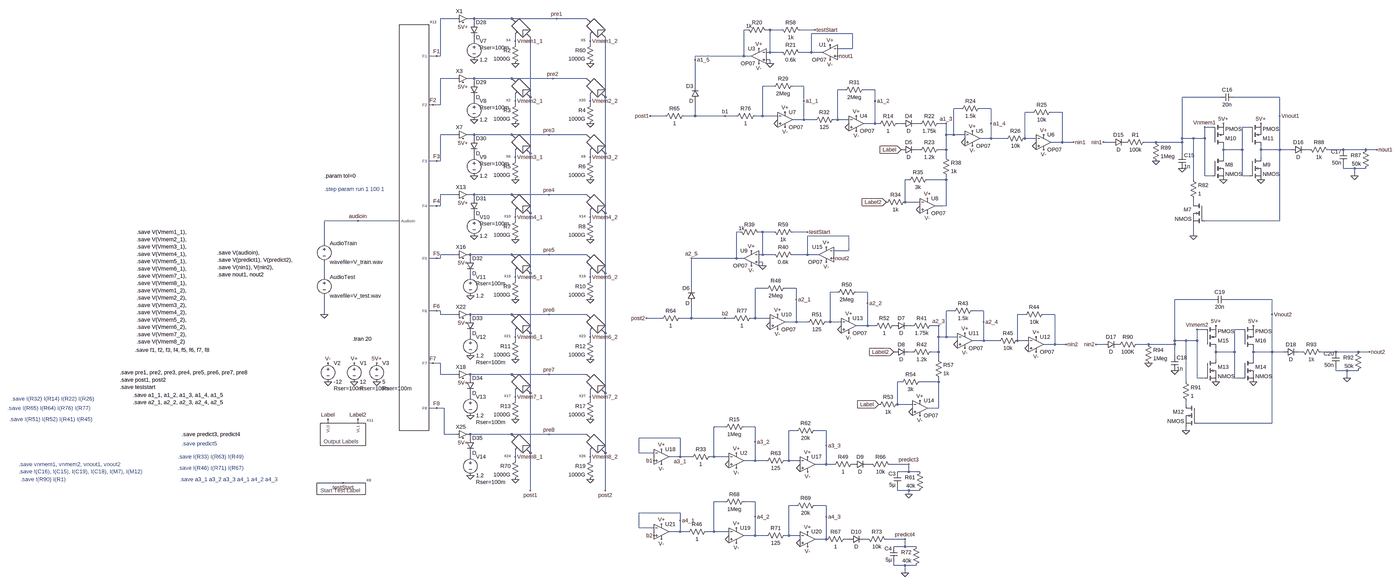
[diagram p0: schematic Net Array_SynapseResponse.asc, whole sheet]
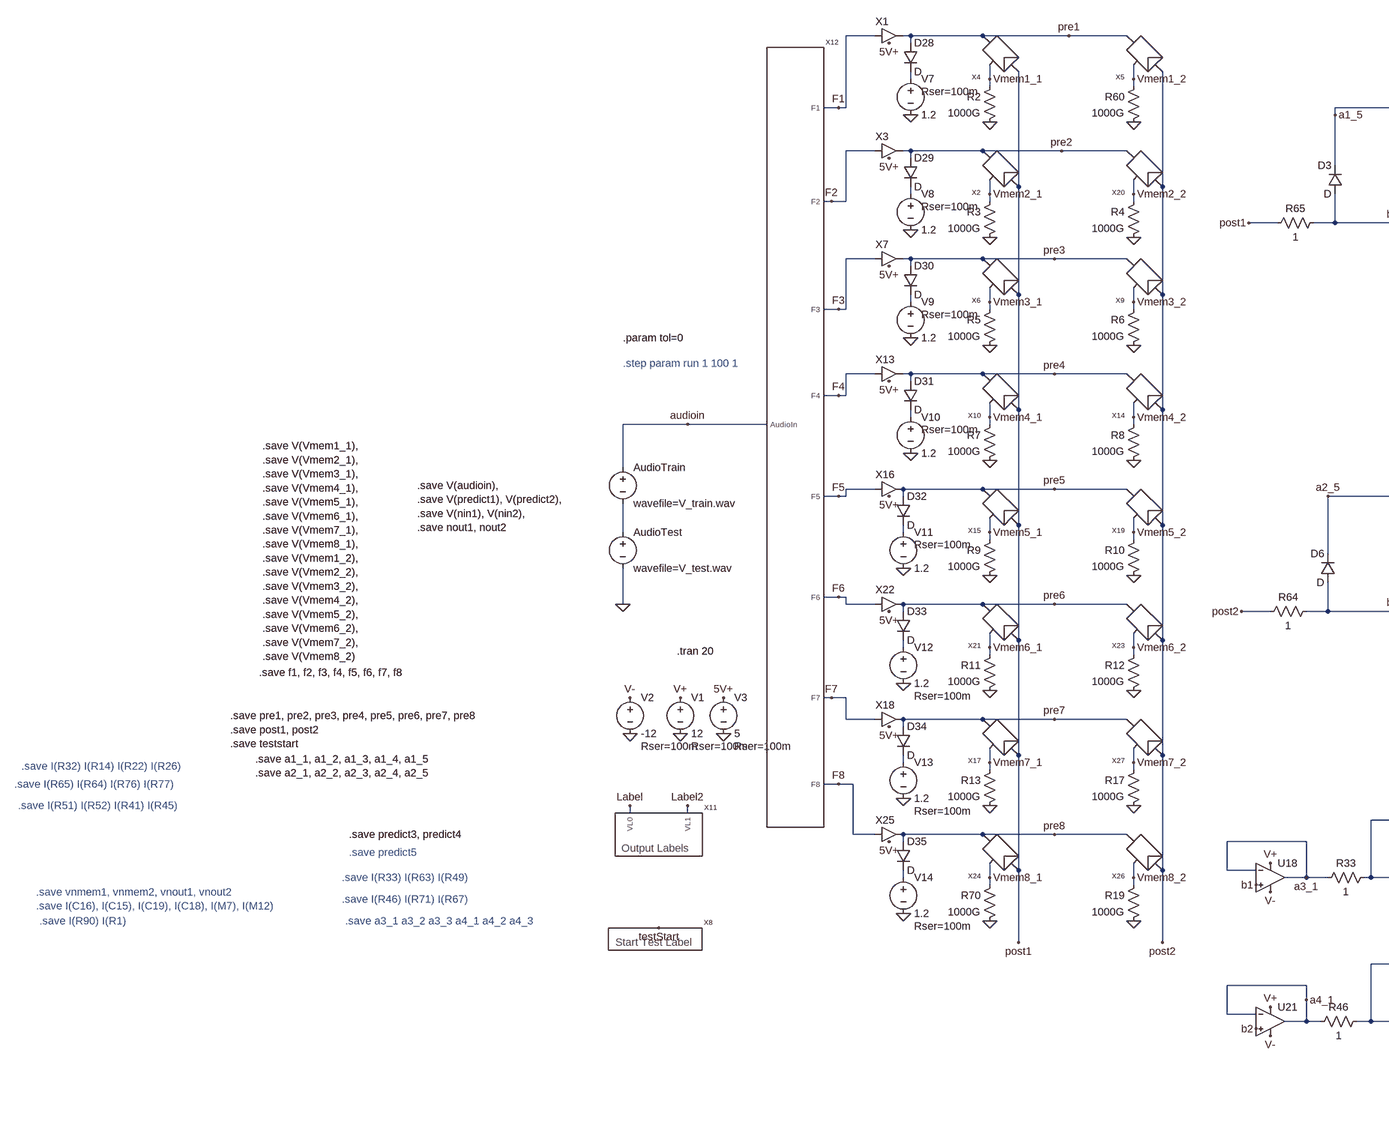
[diagram p1: schematic Net Array_SynapseResponse.asc, part, row 1 of 1, column 1 of 2]
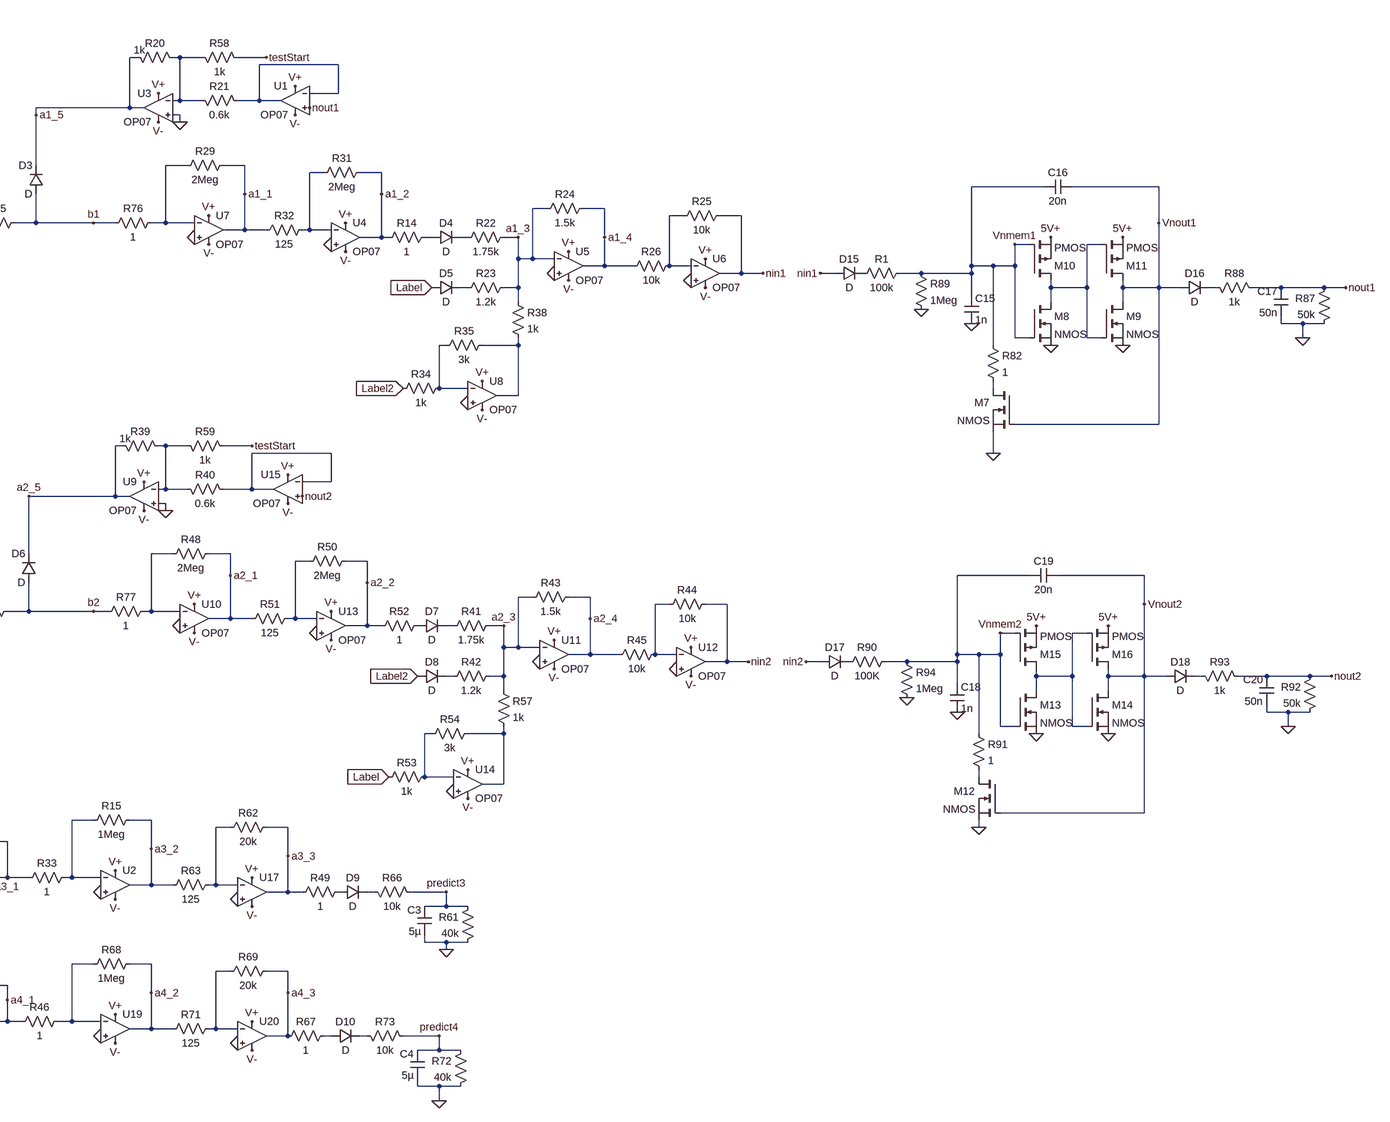
[diagram p2: schematic Net Array_SynapseResponse.asc, part, row 1 of 1, column 2 of 2]
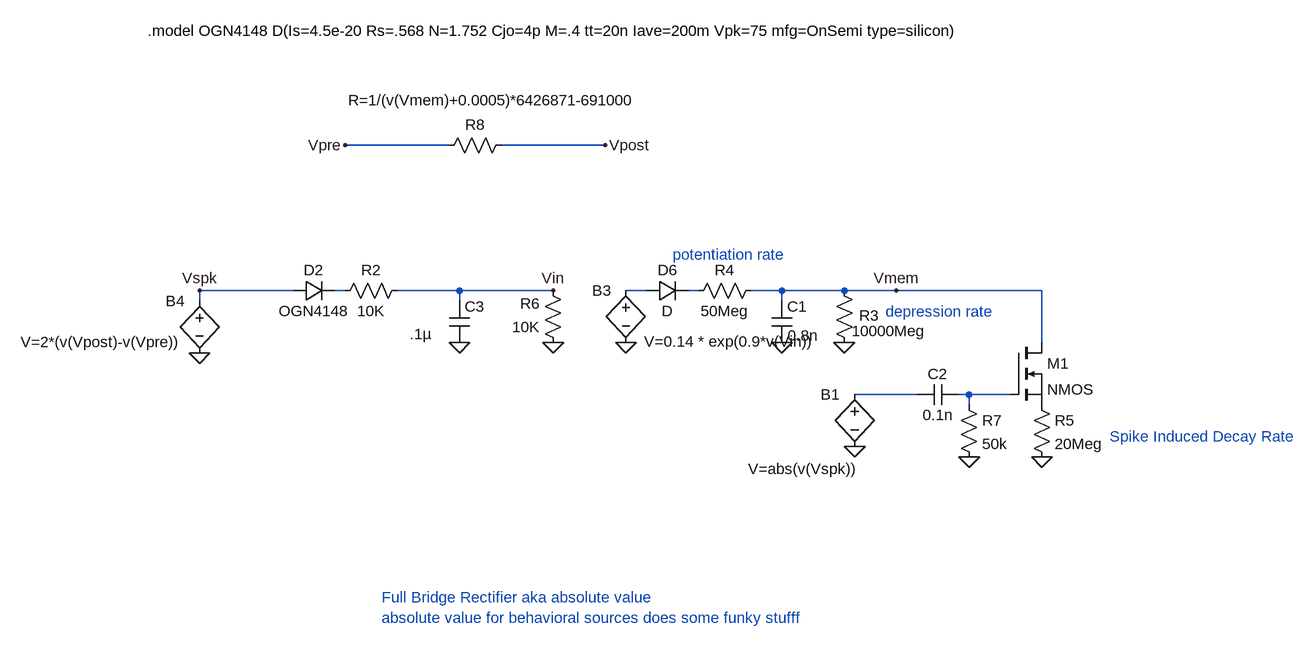
[diagram p3: sub-circuit synapse.asc]
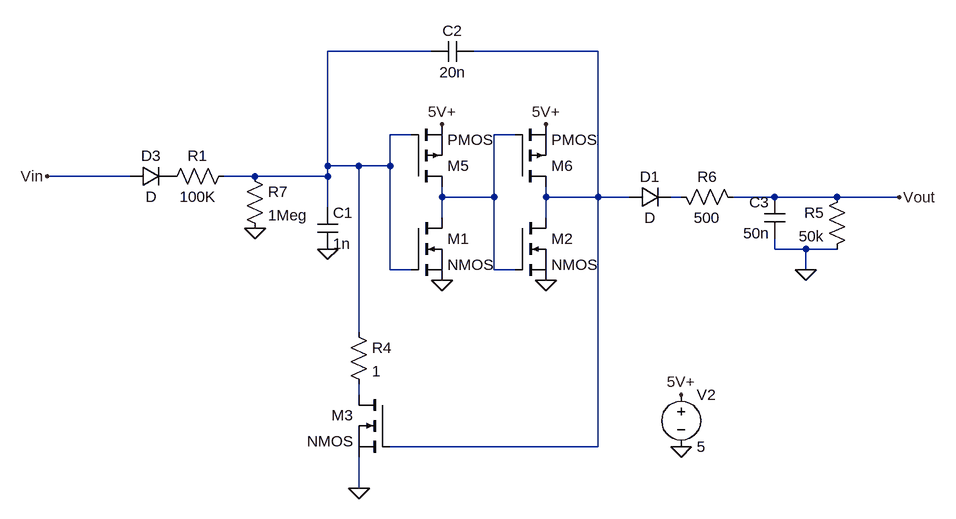
[diagram p4: sub-circuit ahp.asc]
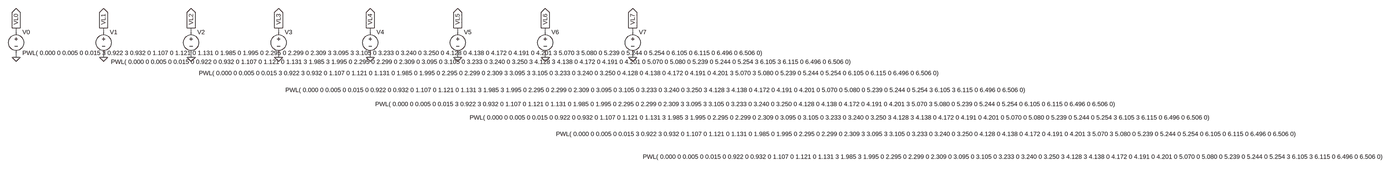
[diagram p5: sub-circuit outputlabels.asc, whole sheet]
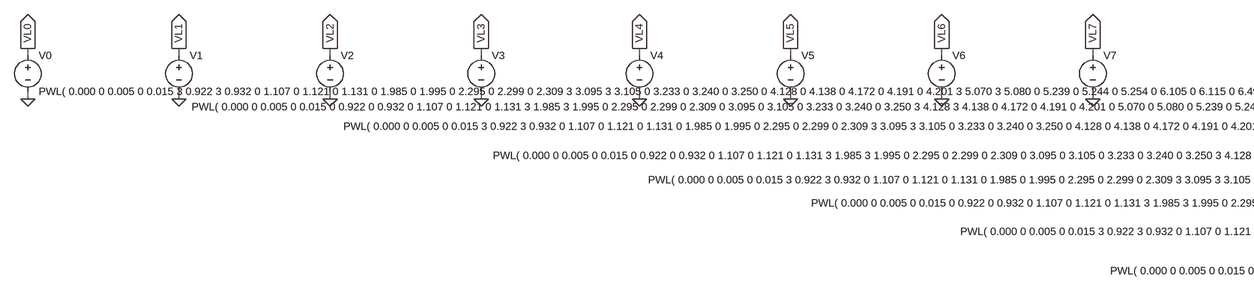
[diagram p6: sub-circuit outputlabels.asc, part, row 1 of 1, column 1 of 2]
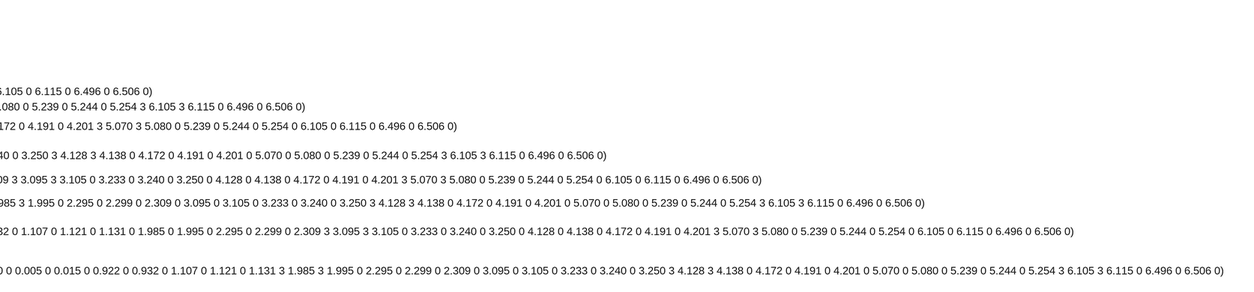
[diagram p7: sub-circuit outputlabels.asc, part, row 1 of 1, column 2 of 2]
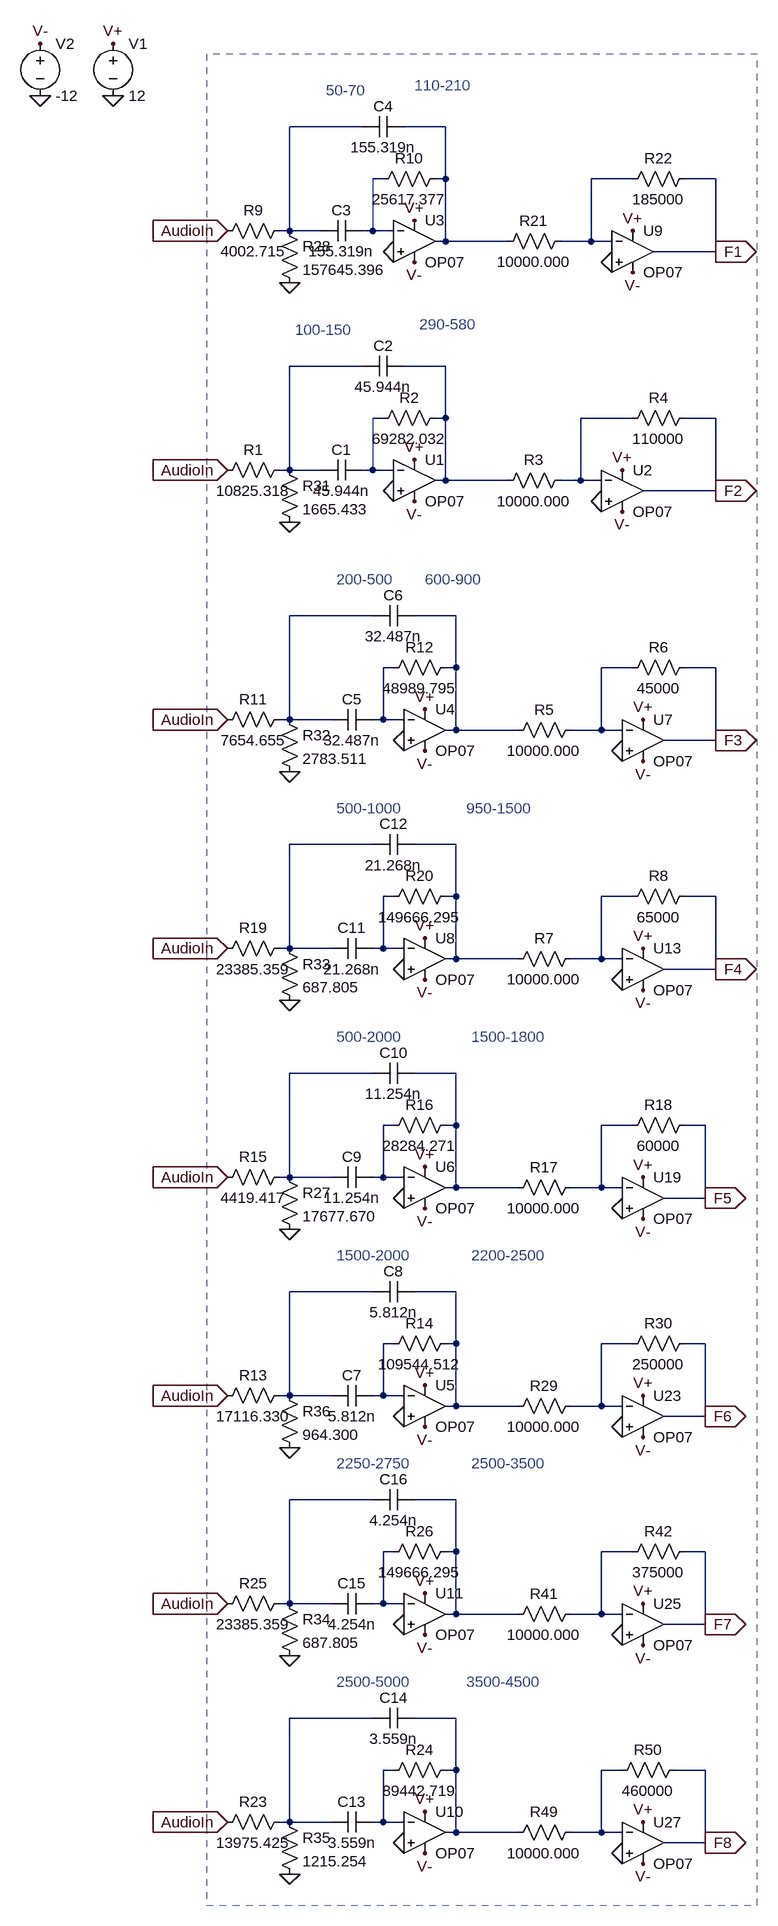
[diagram p8: sub-circuit filterbank.asc]
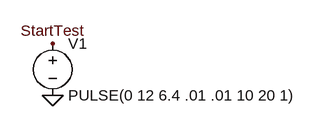
[diagram p9: sub-circuit starttestlabel.asc]
Net Array_SynapseResponse.asc, the LTspice schematic file:
Version 4
SHEET 1 5076 1864
WIRE 80 -1296 16 -1296
WIRE 160 -1296 144 -1296
WIRE 320 -1296 160 -1296
WIRE 512 -1296 320 -1296
WIRE 640 -1296 512 -1296
WIRE 160 -1280 160 -1296
WIRE 1328 -1248 1312 -1248
WIRE 1424 -1248 1408 -1248
WIRE 1472 -1248 1424 -1248
WIRE 1616 -1248 1552 -1248
WIRE 1776 -1232 1600 -1232
WIRE 160 -1200 160 -1216
WIRE 336 -1200 336 -1232
WIRE 656 -1200 656 -1232
WIRE 336 -1184 336 -1200
WIRE 656 -1184 656 -1200
WIRE 1776 -1168 1776 -1232
WIRE 1776 -1168 1712 -1168
WIRE 1424 -1152 1424 -1248
WIRE 1424 -1152 1408 -1152
WIRE 1472 -1152 1424 -1152
WIRE 1600 -1152 1600 -1232
WIRE 1600 -1152 1552 -1152
WIRE 1648 -1152 1600 -1152
WIRE 0 -1136 -32 -1136
WIRE 16 -1136 16 -1296
WIRE 16 -1136 0 -1136
WIRE 1312 -1136 1312 -1248
WIRE 1312 -1136 1104 -1136
WIRE 1344 -1136 1312 -1136
WIRE 1104 -1120 1104 -1136
WIRE 1424 -1120 1408 -1120
WIRE 1424 -1104 1424 -1120
WIRE 80 -1040 16 -1040
WIRE 160 -1040 144 -1040
WIRE 320 -1040 160 -1040
WIRE 496 -1040 320 -1040
WIRE 640 -1040 496 -1040
WIRE 160 -1024 160 -1040
WIRE 1104 -1008 1104 -1120
WIRE 1440 -1008 1392 -1008
WIRE 1568 -1008 1520 -1008
WIRE 1744 -992 1712 -992
WIRE 1872 -992 1824 -992
WIRE 400 -960 400 -1216
WIRE 720 -960 720 -1216
WIRE 3344 -960 3184 -960
WIRE 3600 -960 3408 -960
WIRE 160 -944 160 -960
WIRE 336 -944 336 -976
WIRE 656 -944 656 -976
WIRE 1568 -944 1568 -1008
WIRE 1872 -944 1872 -992
WIRE -16 -928 -32 -928
WIRE 16 -928 16 -1040
WIRE 16 -928 -16 -928
WIRE 336 -928 336 -944
WIRE 656 -928 656 -944
WIRE 2240 -912 2208 -912
WIRE 2368 -912 2320 -912
WIRE 2544 -896 2512 -896
WIRE 2672 -896 2624 -896
WIRE 976 -880 912 -880
WIRE 1104 -880 1104 -944
WIRE 1104 -880 1056 -880
WIRE 1232 -880 1104 -880
WIRE 1280 -880 1232 -880
WIRE 1392 -880 1392 -1008
WIRE 1392 -880 1360 -880
WIRE 1456 -880 1392 -880
WIRE 3600 -880 3600 -960
WIRE 1568 -864 1568 -944
WIRE 1568 -864 1520 -864
WIRE 1616 -864 1568 -864
WIRE 1712 -864 1712 -992
WIRE 1712 -864 1696 -864
WIRE 1760 -864 1712 -864
WIRE 1872 -848 1872 -944
WIRE 1872 -848 1824 -848
WIRE 1888 -848 1872 -848
WIRE 1984 -848 1968 -848
WIRE 2064 -848 2048 -848
WIRE 2176 -848 2144 -848
WIRE 2368 -848 2368 -912
WIRE 3312 -832 3280 -832
WIRE 3472 -832 3440 -832
WIRE 80 -800 16 -800
WIRE 160 -800 144 -800
WIRE 320 -800 160 -800
WIRE 480 -800 320 -800
WIRE 640 -800 480 -800
WIRE 2176 -800 2176 -848
WIRE 2208 -800 2208 -912
WIRE 2208 -800 2176 -800
WIRE 2256 -800 2208 -800
WIRE 160 -784 160 -800
WIRE 2368 -784 2368 -848
WIRE 2368 -784 2320 -784
WIRE 2432 -784 2368 -784
WIRE 2512 -784 2512 -896
WIRE 2560 -784 2512 -784
WIRE 3184 -784 3184 -960
WIRE 3232 -784 3184 -784
WIRE 3280 -784 3280 -832
WIRE 3280 -784 3232 -784
WIRE 2672 -768 2672 -896
WIRE 2672 -768 2624 -768
WIRE 2720 -768 2672 -768
WIRE 2880 -768 2848 -768
WIRE 3072 -768 3024 -768
WIRE 3184 -768 3184 -784
WIRE 3184 -768 3072 -768
WIRE 2064 -736 2048 -736
WIRE 2176 -736 2176 -800
WIRE 2176 -736 2144 -736
WIRE 3360 -736 3360 -752
WIRE 3440 -736 3440 -832
WIRE 3440 -736 3360 -736
WIRE 3520 -736 3520 -752
WIRE 3600 -736 3600 -880
WIRE 3600 -736 3520 -736
WIRE 3648 -736 3600 -736
WIRE 3728 -736 3712 -736
WIRE 3872 -736 3808 -736
WIRE 3968 -736 3872 -736
WIRE 4016 -736 3968 -736
WIRE 400 -720 400 -960
WIRE 720 -720 720 -960
WIRE 3184 -720 3184 -768
WIRE 160 -704 160 -720
WIRE 336 -704 336 -736
WIRE 656 -704 656 -736
WIRE 2176 -704 2176 -736
WIRE 3360 -704 3360 -736
WIRE 3520 -704 3520 -736
WIRE 0 -688 -32 -688
WIRE 16 -688 16 -800
WIRE 16 -688 0 -688
WIRE 336 -688 336 -704
WIRE 656 -688 656 -704
WIRE 3872 -656 3872 -672
WIRE 3920 -656 3872 -656
WIRE 3968 -656 3920 -656
WIRE 3280 -624 3280 -784
WIRE 3312 -624 3280 -624
WIRE 3440 -624 3440 -736
WIRE 3472 -624 3440 -624
WIRE 3920 -624 3920 -656
WIRE 2016 -608 2000 -608
WIRE 2176 -608 2176 -624
WIRE 2176 -608 2096 -608
WIRE 3232 -608 3232 -784
WIRE 80 -544 16 -544
WIRE 160 -544 144 -544
WIRE 320 -544 160 -544
WIRE 480 -544 320 -544
WIRE 640 -544 480 -544
WIRE 160 -528 160 -544
WIRE 2000 -512 2000 -608
WIRE 2064 -512 2000 -512
WIRE 3232 -512 3232 -528
WIRE 0 -496 -32 -496
WIRE 16 -496 16 -544
WIRE 16 -496 0 -496
WIRE 2176 -496 2176 -608
WIRE 2176 -496 2128 -496
WIRE 400 -464 400 -720
WIRE 720 -464 720 -720
WIRE 160 -448 160 -464
WIRE 336 -448 336 -480
WIRE 656 -448 656 -480
WIRE -336 -432 -480 -432
WIRE -160 -432 -336 -432
WIRE 336 -432 336 -448
WIRE 656 -432 656 -448
WIRE 3600 -432 3600 -736
WIRE 3600 -432 3280 -432
WIRE 1296 -384 1280 -384
WIRE 1392 -384 1376 -384
WIRE 1440 -384 1392 -384
WIRE 1584 -384 1520 -384
WIRE 1760 -368 1584 -368
WIRE 3232 -368 3232 -416
WIRE -480 -336 -480 -432
WIRE 1760 -304 1760 -368
WIRE 1760 -304 1696 -304
WIRE 80 -288 16 -288
WIRE 320 -288 144 -288
WIRE 480 -288 320 -288
WIRE 640 -288 480 -288
WIRE 1392 -288 1392 -384
WIRE 1392 -288 1376 -288
WIRE 1440 -288 1392 -288
WIRE 1584 -288 1584 -368
WIRE 1584 -288 1520 -288
WIRE 1632 -288 1584 -288
WIRE 0 -272 -32 -272
WIRE 16 -272 16 -288
WIRE 16 -272 0 -272
WIRE 144 -272 144 -288
WIRE 1280 -272 1280 -384
WIRE 1280 -272 1088 -272
WIRE 1312 -272 1280 -272
WIRE 1392 -256 1376 -256
WIRE 1392 -240 1392 -256
WIRE 400 -208 400 -464
WIRE 720 -208 720 -464
WIRE -480 -192 -480 -256
WIRE 144 -192 144 -208
WIRE 336 -192 336 -224
WIRE 656 -192 656 -224
WIRE 336 -176 336 -192
WIRE 656 -176 656 -192
WIRE 1088 -144 1088 -272
WIRE 1408 -144 1360 -144
WIRE 1536 -144 1488 -144
WIRE 1712 -128 1680 -128
WIRE 1840 -128 1792 -128
WIRE 1536 -96 1536 -144
WIRE 3312 -96 3152 -96
WIRE 3568 -96 3376 -96
WIRE 1840 -80 1840 -128
WIRE 0 -48 -32 -48
WIRE 16 -48 0 -48
WIRE 2208 -48 2176 -48
WIRE 2336 -48 2288 -48
WIRE -480 -32 -480 -112
WIRE 16 -32 16 -48
WIRE 80 -32 16 -32
WIRE 320 -32 144 -32
WIRE 480 -32 320 -32
WIRE 640 -32 480 -32
WIRE 2512 -32 2480 -32
WIRE 2640 -32 2592 -32
WIRE 3568 -32 3568 -96
WIRE 144 -16 144 -32
WIRE 960 -16 896 -16
WIRE 1088 -16 1088 -80
WIRE 1088 -16 1040 -16
WIRE 1232 -16 1088 -16
WIRE 1264 -16 1232 -16
WIRE 1360 -16 1360 -144
WIRE 1360 -16 1344 -16
WIRE 1424 -16 1360 -16
WIRE 1536 0 1536 -96
WIRE 1536 0 1488 0
WIRE 1584 0 1536 0
WIRE 1680 0 1680 -128
WIRE 1680 0 1664 0
WIRE 1728 0 1680 0
WIRE 2336 0 2336 -48
WIRE 1840 16 1840 -80
WIRE 1840 16 1792 16
WIRE 1872 16 1840 16
WIRE 2032 16 2016 16
WIRE 2144 16 2112 16
WIRE 3280 32 3248 32
WIRE 3440 32 3408 32
WIRE 400 48 400 -208
WIRE 720 48 720 -208
WIRE 144 64 144 48
WIRE 336 64 336 32
WIRE 656 64 656 32
WIRE 2144 64 2144 16
WIRE 2176 64 2176 -48
WIRE 2176 64 2144 64
WIRE 2224 64 2176 64
WIRE 336 80 336 64
WIRE 656 80 656 64
WIRE 2336 80 2336 0
WIRE 2336 80 2288 80
WIRE 2400 80 2336 80
WIRE 2480 80 2480 -32
WIRE 2528 80 2480 80
WIRE 3152 80 3152 -96
WIRE 3200 80 3152 80
WIRE 3248 80 3248 32
WIRE 3248 80 3200 80
WIRE 2640 96 2640 -32
WIRE 2640 96 2592 96
WIRE 2688 96 2640 96
WIRE 2848 96 2816 96
WIRE 3040 96 2992 96
WIRE 3152 96 3152 80
WIRE 3152 96 3040 96
WIRE 2032 128 2016 128
WIRE 2144 128 2144 64
WIRE 2144 128 2112 128
WIRE 3328 128 3328 112
WIRE 3408 128 3408 32
WIRE 3408 128 3328 128
WIRE 3488 128 3488 112
WIRE 3568 128 3568 -32
WIRE 3568 128 3488 128
WIRE 3616 128 3568 128
WIRE 3696 128 3680 128
WIRE 3840 128 3776 128
WIRE 3936 128 3840 128
WIRE 3984 128 3936 128
WIRE 3152 144 3152 96
WIRE 2144 160 2144 128
WIRE 3328 160 3328 128
WIRE 3488 160 3488 128
WIRE -16 176 -32 176
WIRE 16 176 -16 176
WIRE 3840 208 3840 192
WIRE 3888 208 3840 208
WIRE 3936 208 3888 208
WIRE 16 224 16 176
WIRE 80 224 16 224
WIRE 320 224 144 224
WIRE 480 224 320 224
WIRE 640 224 480 224
WIRE 144 240 144 224
WIRE 3248 240 3248 80
WIRE 3280 240 3248 240
WIRE 3408 240 3408 128
WIRE 3440 240 3408 240
WIRE 3888 240 3888 208
WIRE 1984 256 1968 256
WIRE 2144 256 2144 240
WIRE 2144 256 2064 256
WIRE 3200 256 3200 80
WIRE 400 304 400 48
WIRE 720 304 720 48
WIRE 144 320 144 304
WIRE 336 320 336 288
WIRE 656 320 656 288
WIRE 336 336 336 320
WIRE 656 336 656 320
WIRE 1968 352 1968 256
WIRE 2032 352 1968 352
WIRE 3200 352 3200 336
WIRE 0 368 -32 368
WIRE 32 368 0 368
WIRE 2144 368 2144 256
WIRE 2144 368 2096 368
WIRE -464 432 -464 416
WIRE -336 432 -336 416
WIRE 3568 432 3568 128
WIRE 3568 432 3248 432
WIRE 1232 448 1184 448
WIRE 1360 448 1312 448
WIRE 1536 464 1504 464
WIRE 1664 464 1616 464
WIRE 3200 464 3200 448
WIRE 32 480 32 368
WIRE 80 480 32 480
WIRE 320 480 144 480
WIRE 480 480 320 480
WIRE 640 480 480 480
WIRE 144 496 144 480
WIRE 1040 496 864 496
WIRE 1360 512 1360 448
WIRE 1664 528 1664 464
WIRE 400 560 400 304
WIRE 720 560 720 304
WIRE 864 560 864 496
WIRE 928 560 864 560
WIRE 144 576 144 560
WIRE 336 576 336 544
WIRE 656 576 656 544
WIRE 1040 576 1040 496
WIRE 1040 576 992 576
WIRE 1088 576 1040 576
WIRE 1184 576 1184 448
WIRE 1184 576 1168 576
WIRE 1248 576 1184 576
WIRE 336 592 336 576
WIRE 656 592 656 576
WIRE 1360 592 1360 512
WIRE 1360 592 1312 592
WIRE 1408 592 1360 592
WIRE 1504 592 1504 464
WIRE 1504 592 1488 592
WIRE 1552 592 1504 592
WIRE 1664 608 1664 528
WIRE 1664 608 1616 608
WIRE 1696 608 1664 608
WIRE 1856 608 1840 608
WIRE 2016 608 1936 608
WIRE 2016 640 2016 608
WIRE 2016 640 1968 640
WIRE 2064 640 2016 640
WIRE 400 720 400 560
WIRE 720 720 720 560
WIRE 1968 720 1968 704
WIRE 2016 720 1968 720
WIRE 2064 720 2016 720
WIRE 2016 736 2016 720
WIRE 1232 768 1184 768
WIRE 1360 768 1312 768
WIRE 1536 784 1504 784
WIRE 1664 784 1616 784
WIRE 1040 816 864 816
WIRE 1360 832 1360 768
WIRE 1664 832 1664 784
WIRE 1040 848 1040 816
WIRE 864 880 864 816
WIRE 928 880 864 880
WIRE 1040 896 1040 848
WIRE 1040 896 992 896
WIRE 1072 896 1040 896
WIRE 1184 896 1184 768
WIRE 1184 896 1152 896
WIRE 1248 896 1184 896
WIRE 1360 912 1360 832
WIRE 1360 912 1312 912
WIRE 1408 912 1360 912
WIRE 1504 912 1504 784
WIRE 1504 912 1488 912
WIRE 1552 912 1504 912
WIRE 1664 928 1664 832
WIRE 1664 928 1616 928
WIRE 1760 928 1744 928
WIRE 1840 928 1824 928
WIRE 2000 928 1920 928
WIRE 2000 960 2000 928
WIRE 2000 960 1952 960
WIRE 2048 960 2000 960
WIRE 1952 1040 1952 1024
WIRE 2000 1040 1952 1040
WIRE 2048 1040 2000 1040
WIRE 2000 1072 2000 1040
FLAG -480 -32 0
FLAG -464 256 0
FLAG -352 256 0
FLAG -352 176 V+
FLAG -464 176 V-
FLAG -464 416 Label
FLAG -336 416 Label2
FLAG -336 -432 audioin
FLAG 336 -848 0
FLAG 336 -944 Vmem2_1
FLAG 656 -848 0
FLAG 656 -944 Vmem2_2
FLAG 336 -608 0
FLAG 336 -704 Vmem3_1
FLAG 656 -608 0
FLAG 656 -704 Vmem3_2
FLAG 336 -352 0
FLAG 336 -448 Vmem4_1
FLAG 656 -352 0
FLAG 656 -448 Vmem4_2
FLAG 336 -96 0
FLAG 336 -192 Vmem5_1
FLAG 656 -96 0
FLAG 656 -192 Vmem5_2
FLAG 336 160 0
FLAG 336 64 Vmem6_1
FLAG 656 160 0
FLAG 656 64 Vmem6_2
FLAG 336 416 0
FLAG 336 320 Vmem7_1
FLAG 656 416 0
FLAG 656 320 Vmem7_2
FLAG 512 -1296 pre1
FLAG 400 720 post1
FLAG 336 672 0
FLAG 336 576 Vmem8_1
FLAG 656 672 0
FLAG 656 576 Vmem8_2
FLAG 720 720 post2
FLAG -256 256 0
FLAG -256 176 5V+
FLAG 912 -880 post1
FLAG 2720 -768 nin1
FLAG 4016 -736 nout1
FLAG 1376 -1104 V-
FLAG 1376 -1168 V+
FLAG 1424 -1104 0
FLAG 1488 -832 V-
FLAG 1488 -896 V+
FLAG 2256 -768 0
FLAG 2560 -752 0
FLAG 2288 -816 V+
FLAG 2592 -800 V+
FLAG 2288 -752 V-
FLAG 2592 -736 V-
FLAG 1456 -848 0
FLAG 1760 -832 0
FLAG 1792 -880 V+
FLAG 1792 -816 V-
FLAG 2096 -464 V-
FLAG 2096 -528 V+
FLAG 2064 -480 0
FLAG 1984 -736 Label
IOPIN 1984 -736 In
FLAG 1920 -512 Label2
IOPIN 1920 -512 In
FLAG 896 -16 post2
FLAG 2688 96 nin2
FLAG 1344 -240 V-
FLAG 1344 -304 V+
FLAG 1392 -240 0
FLAG 1456 32 V-
FLAG 1456 -32 V+
FLAG 2224 96 0
FLAG 2528 112 0
FLAG 2256 48 V+
FLAG 2560 64 V+
FLAG 2256 112 V-
FLAG 2560 128 V-
FLAG 1424 16 0
FLAG 1728 32 0
FLAG 1760 -16 V+
FLAG 1760 48 V-
FLAG 2064 336 V+
FLAG 1952 128 Label2
IOPIN 1952 128 In
FLAG 1888 352 Label
IOPIN 1888 352 In
FLAG -400 688 testStart
FLAG 1584 -384 testStart
FLAG 1616 -1248 testStart
FLAG 496 -1040 pre2
FLAG 480 -800 pre3
FLAG 480 -544 pre4
FLAG 480 -288 pre5
FLAG 480 -32 pre6
FLAG 480 224 pre7
FLAG 480 480 pre8
FLAG 1568 -944 a1_1
FLAG 1872 -944 a1_2
FLAG 2176 -848 a1_3
FLAG 2368 -848 a1_4
FLAG 1104 -1120 a1_5
FLAG 1536 -96 a2_1
FLAG 1840 -80 a2_2
FLAG 2144 16 a2_3
FLAG 1088 -272 a2_5
FLAG 2336 0 a2_4
FLAG 160 -1120 0
FLAG 160 -864 0
FLAG 160 -624 0
FLAG 160 -368 0
FLAG 144 -112 0
FLAG 144 144 0
FLAG 144 400 0
FLAG 144 656 0
FLAG 3184 -656 0
FLAG 3360 -848 5V+
FLAG 3520 -848 5V+
FLAG 3520 -608 0
FLAG 3360 -608 0
FLAG 3232 -368 0
FLAG 3920 -624 0
FLAG 3072 -688 0
FLAG 3152 208 0
FLAG 3328 16 5V+
FLAG 3488 16 5V+
FLAG 3488 256 0
FLAG 3328 256 0
FLAG 3200 464 0
FLAG 3888 240 0
FLAG 3040 176 0
FLAG 2816 96 nin2
FLAG 2848 -768 nin1
FLAG 3984 128 nout2
FLAG 3280 -832 Vnmem1
FLAG 3248 32 Vnmem2
FLAG 3600 -880 Vnout1
FLAG 3568 -32 Vnout2
FLAG 1680 -1184 V+
FLAG 1680 -1120 V-
FLAG 1712 -1136 nout1
FLAG 1664 -320 V+
FLAG 1664 -256 V-
FLAG 1696 -272 nout2
FLAG 0 -1136 F1
FLAG -16 -928 F2
FLAG 0 -688 F3
FLAG 0 -496 F4
FLAG 0 -272 F5
FLAG 0 -48 F6
FLAG -16 176 F7
FLAG 0 368 F8
FLAG 336 -1104 0
FLAG 336 -1200 Vmem1_1
FLAG 656 -1104 0
FLAG 656 -1200 Vmem1_2
FLAG 2064 400 V-
FLAG 1280 624 V-
FLAG 1280 560 V+
FLAG 1248 608 0
FLAG 1552 624 0
FLAG 1584 576 V+
FLAG 1584 640 V-
FLAG 1232 -880 b1
FLAG 1232 -16 b2
FLAG 960 544 V+
FLAG 960 608 V-
FLAG 2016 736 0
FLAG 2016 608 predict3
FLAG 928 592 b1
FLAG 1280 944 V-
FLAG 1280 880 V+
FLAG 1248 928 0
FLAG 1552 944 0
FLAG 1584 896 V+
FLAG 1584 960 V-
FLAG 960 864 V+
FLAG 960 928 V-
FLAG 2000 1072 0
FLAG 2000 928 predict4
FLAG 928 912 b2
FLAG 1040 576 a3_1
FLAG 1360 512 a3_2
FLAG 1664 528 a3_3
FLAG 1040 848 a4_1
FLAG 1360 832 a4_2
FLAG 1664 832 a4_3
FLAG 2032 384 0
FLAG 112 240 5V+
FLAG 112 496 5V+
FLAG 112 -16 5V+
FLAG 112 -272 5V+
FLAG 112 -528 5V+
FLAG 112 -784 5V+
FLAG 112 -1024 5V+
FLAG 112 -1280 5V+
SYMBOL Synapse 400 -960 R180
SYMATTR InstName X2
SYMBOL AHP 80 -1040 R0
SYMATTR InstName X3
SYMATTR SpiceLine Rinhibition = 1Meg
SYMBOL Synapse 400 304 R180
SYMATTR InstName X17
SYMBOL AHP 80 224 R0
SYMATTR InstName X18
SYMATTR SpiceLine Rinhibition = 1Meg
SYMBOL Synapse 720 -960 R180
SYMATTR InstName X20
SYMBOL Synapse 720 304 R180
SYMATTR InstName X27
SYMBOL OutputLabels -496 528 R0
SYMATTR InstName X11
SYMBOL voltage -480 -352 R0
SYMATTR InstName AudioTrain
SYMATTR Value wavefile=V_train.wav
SYMBOL voltage -480 -208 R0
SYMATTR InstName AudioTest
SYMATTR Value wavefile=V_test.wav
SYMBOL FilterBank -160 464 R0
SYMATTR InstName X12
SYMBOL voltage -352 160 R0
WINDOW 123 0 0 Left 2
WINDOW 39 24 124 Left 2
SYMATTR SpiceLine Rser=100m
SYMATTR InstName V1
SYMATTR Value 12
SYMBOL voltage -464 160 R0
WINDOW 123 0 0 Left 2
WINDOW 39 24 124 Left 2
SYMATTR SpiceLine Rser=100m
SYMATTR InstName V2
SYMATTR Value -12
SYMBOL Synapse 400 -720 R180
SYMATTR InstName X6
SYMBOL AHP 80 -800 R0
SYMATTR InstName X7
SYMATTR SpiceLine Rinhibition = 1Meg
SYMBOL Synapse 720 -720 R180
SYMATTR InstName X9
SYMBOL Synapse 400 -464 R180
SYMATTR InstName X10
SYMBOL AHP 80 -544 R0
SYMATTR InstName X13
SYMATTR SpiceLine Rinhibition = 1Meg
SYMBOL Synapse 720 -464 R180
SYMATTR InstName X14
SYMBOL Synapse 400 -208 R180
SYMATTR InstName X15
SYMBOL AHP 80 -288 R0
SYMATTR InstName X16
SYMATTR SpiceLine Rinhibition = 1Meg
SYMBOL Synapse 720 -208 R180
SYMATTR InstName X19
SYMBOL Synapse 400 48 R180
SYMATTR InstName X21
SYMBOL AHP 80 -32 R0
SYMATTR InstName X22
SYMATTR SpiceLine Rinhibition = 1Meg
SYMBOL Synapse 720 48 R180
SYMATTR InstName X23
SYMBOL Synapse 400 560 R180
SYMATTR InstName X24
SYMBOL AHP 80 480 R0
SYMATTR InstName X25
SYMATTR SpiceLine Rinhibition = 1Meg
SYMBOL Synapse 720 560 R180
SYMATTR InstName X26
SYMBOL res 352 -944 M0
SYMATTR InstName R3
SYMATTR Value 1000G
SYMBOL res 672 -944 M0
SYMATTR InstName R4
SYMATTR Value 1000G
SYMBOL res 352 -704 M0
SYMATTR InstName R5
SYMATTR Value 1000G
SYMBOL res 672 -704 M0
SYMATTR InstName R6
SYMATTR Value 1000G
SYMBOL res 352 -448 M0
SYMATTR InstName R7
SYMATTR Value 1000G
SYMBOL res 672 -448 M0
SYMATTR InstName R8
SYMATTR Value 1000G
SYMBOL res 352 -192 M0
SYMATTR InstName R9
SYMATTR Value 1000G
SYMBOL res 672 -192 M0
SYMATTR InstName R10
SYMATTR Value 1000G
SYMBOL res 352 64 M0
SYMATTR InstName R11
SYMATTR Value 1000G
SYMBOL res 672 64 M0
SYMATTR InstName R12
SYMATTR Value 1000G
SYMBOL res 352 320 M0
SYMATTR InstName R13
SYMATTR Value 1000G
SYMBOL res 672 320 M0
SYMATTR InstName R17
SYMATTR Value 1000G
SYMBOL res 352 576 M0
SYMATTR InstName R70
SYMATTR Value 1000G
SYMBOL res 672 576 M0
SYMATTR InstName R19
SYMATTR Value 1000G
SYMBOL voltage -256 160 R0
WINDOW 123 0 0 Left 2
WINDOW 39 24 124 Left 2
SYMATTR SpiceLine Rser=100m
SYMATTR InstName V3
SYMATTR Value 5
SYMBOL res 1312 -1264 M90
WINDOW 0 0 56 VBottom 2
WINDOW 3 -16 22 VTop 2
SYMATTR InstName R20
SYMATTR Value 1k
SYMBOL res 1456 -1168 M90
WINDOW 0 0 56 VBottom 2
WINDOW 3 32 56 VTop 2
SYMATTR InstName R21
SYMATTR Value 0.6k
SYMBOL diode 1120 -944 R180
WINDOW 0 24 64 Left 2
WINDOW 3 24 0 Left 2
SYMATTR InstName D3
SYMBOL diode 1984 -832 R270
WINDOW 0 32 32 VTop 2
WINDOW 3 0 32 VBottom 2
SYMATTR InstName D4
SYMBOL Opamps\\OP07 2288 -848 R0
SYMATTR InstName U5
SYMBOL res 2160 -864 R90
WINDOW 0 0 56 VBottom 2
WINDOW 3 32 56 VTop 2
SYMATTR InstName R22
SYMATTR Value 1.75k
SYMBOL res 2160 -752 R90
WINDOW 0 0 56 VBottom 2
WINDOW 3 32 56 VTop 2
SYMATTR InstName R23
SYMATTR Value 1.2k
SYMBOL res 2336 -928 R90
WINDOW 0 0 56 VBottom 2
WINDOW 3 32 56 VTop 2
SYMATTR InstName R24
SYMATTR Value 1.5k
SYMBOL Opamps\\OP07 2592 -832 R0
SYMATTR InstName U6
SYMBOL res 2640 -912 R90
WINDOW 0 0 56 VBottom 2
WINDOW 3 32 56 VTop 2
SYMATTR InstName R25
SYMATTR Value 10k
SYMBOL res 2528 -800 R90
WINDOW 0 0 56 VBottom 2
WINDOW 3 32 56 VTop 2
SYMATTR InstName R26
SYMATTR Value 10k
SYMBOL diode 1984 -720 R270
WINDOW 0 32 32 VTop 2
WINDOW 3 0 32 VBottom 2
SYMATTR InstName D5
SYMBOL res 1536 -1024 R90
WINDOW 0 0 56 VBottom 2
WINDOW 3 32 56 VTop 2
SYMATTR InstName R29
SYMATTR Value 2Meg
SYMBOL res 1840 -1008 R90
WINDOW 0 0 56 VBottom 2
WINDOW 3 32 56 VTop 2
SYMATTR InstName R31
SYMATTR Value 2Meg
SYMBOL res 1712 -880 R90
WINDOW 0 0 56 VBottom 2
WINDOW 3 32 56 VTop 2
SYMATTR InstName R32
SYMATTR Value 125
SYMBOL res 2016 -528 R90
WINDOW 0 0 56 VBottom 2
WINDOW 3 32 56 VTop 2
SYMATTR InstName R34
SYMATTR Value 1k
SYMBOL res 2112 -624 R90
WINDOW 0 0 56 VBottom 2
WINDOW 3 32 56 VTop 2
SYMATTR InstName R35
SYMATTR Value 3k
SYMBOL res 2160 -720 R0
SYMATTR InstName R38
SYMATTR Value 1k
SYMBOL res 1280 -400 M90
WINDOW 0 0 56 VBottom 2
WINDOW 3 -16 22 VTop 2
SYMATTR InstName R39
SYMATTR Value 1k
SYMBOL res 1424 -304 M90
WINDOW 0 0 56 VBottom 2
WINDOW 3 32 56 VTop 2
SYMATTR InstName R40
SYMATTR Value 0.6k
SYMBOL diode 1104 -80 R180
WINDOW 0 24 64 Left 2
WINDOW 3 24 0 Left 2
SYMATTR InstName D6
SYMBOL diode 1952 32 R270
WINDOW 0 32 32 VTop 2
WINDOW 3 0 32 VBottom 2
SYMATTR InstName D7
SYMBOL Opamps\\OP07 2256 16 R0
SYMATTR InstName U11
SYMBOL res 2128 0 R90
WINDOW 0 0 56 VBottom 2
WINDOW 3 32 56 VTop 2
SYMATTR InstName R41
SYMATTR Value 1.75k
SYMBOL res 2128 112 R90
WINDOW 0 0 56 VBottom 2
WINDOW 3 32 56 VTop 2
SYMATTR InstName R42
SYMATTR Value 1.2k
SYMBOL res 2304 -64 R90
WINDOW 0 0 56 VBottom 2
WINDOW 3 32 56 VTop 2
SYMATTR InstName R43
SYMATTR Value 1.5k
SYMBOL Opamps\\OP07 2560 32 R0
SYMATTR InstName U12
SYMBOL res 2608 -48 R90
WINDOW 0 0 56 VBottom 2
WINDOW 3 32 56 VTop 2
SYMATTR InstName R44
SYMATTR Value 10k
SYMBOL res 2496 64 R90
WINDOW 0 0 56 VBottom 2
WINDOW 3 32 56 VTop 2
SYMATTR InstName R45
SYMATTR Value 10k
SYMBOL diode 1952 144 R270
WINDOW 0 32 32 VTop 2
WINDOW 3 0 32 VBottom 2
SYMATTR InstName D8
SYMBOL res 1504 -160 R90
WINDOW 0 0 56 VBottom 2
WINDOW 3 32 56 VTop 2
SYMATTR InstName R48
SYMATTR Value 2Meg
SYMBOL res 1808 -144 R90
WINDOW 0 0 56 VBottom 2
WINDOW 3 32 56 VTop 2
SYMATTR InstName R50
SYMATTR Value 2Meg
SYMBOL res 1680 -16 R90
WINDOW 0 0 56 VBottom 2
WINDOW 3 32 56 VTop 2
SYMATTR InstName R51
SYMATTR Value 125
SYMBOL res 1984 336 R90
WINDOW 0 0 56 VBottom 2
WINDOW 3 32 56 VTop 2
SYMATTR InstName R53
SYMATTR Value 1k
SYMBOL res 2080 240 R90
WINDOW 0 0 56 VBottom 2
WINDOW 3 32 56 VTop 2
SYMATTR InstName R54
SYMATTR Value 3k
SYMBOL res 2128 144 R0
SYMATTR InstName R57
SYMATTR Value 1k
SYMBOL res 1456 -1264 M90
WINDOW 0 0 56 VBottom 2
WINDOW 3 32 56 VTop 2
SYMATTR InstName R58
SYMATTR Value 1k
SYMBOL res 1424 -400 M90
WINDOW 0 0 56 VBottom 2
WINDOW 3 32 56 VTop 2
SYMATTR InstName R59
SYMATTR Value 1k
SYMBOL StartTestLabel -512 736 R0
SYMATTR InstName X8
SYMBOL voltage 160 -1216 R0
WINDOW 123 0 0 Left 2
WINDOW 39 24 44 Left 2
SYMATTR SpiceLine Rser=100m
SYMATTR InstName V7
SYMATTR Value 1.2
SYMBOL diode 144 -1280 R0
SYMATTR InstName D28
SYMBOL voltage 160 -960 R0
WINDOW 123 0 0 Left 2
WINDOW 39 24 44 Left 2
SYMATTR SpiceLine Rser=100m
SYMATTR InstName V8
SYMATTR Value 1.2
SYMBOL diode 144 -1024 R0
SYMATTR InstName D29
SYMBOL voltage 160 -720 R0
WINDOW 123 0 0 Left 2
WINDOW 39 24 44 Left 2
SYMATTR SpiceLine Rser=100m
SYMATTR InstName V9
SYMATTR Value 1.2
SYMBOL diode 144 -784 R0
SYMATTR InstName D30
SYMBOL voltage 160 -464 R0
WINDOW 123 0 0 Left 2
WINDOW 39 24 44 Left 2
SYMATTR SpiceLine Rser=100m
SYMATTR InstName V10
SYMATTR Value 1.2
SYMBOL diode 144 -528 R0
SYMATTR InstName D31
SYMBOL voltage 144 -208 R0
WINDOW 123 0 0 Left 2
WINDOW 39 24 44 Left 2
SYMATTR SpiceLine Rser=100m
SYMATTR InstName V11
SYMATTR Value 1.2
SYMBOL diode 128 -272 R0
SYMATTR InstName D32
SYMBOL voltage 144 48 R0
WINDOW 123 0 0 Left 2
WINDOW 39 24 124 Left 2
SYMATTR SpiceLine Rser=100m
SYMATTR InstName V12
SYMATTR Value 1.2
SYMBOL diode 128 -16 R0
SYMATTR InstName D33
SYMBOL voltage 144 304 R0
WINDOW 123 0 0 Left 2
WINDOW 39 24 124 Left 2
SYMATTR SpiceLine Rser=100m
SYMATTR InstName V13
SYMATTR Value 1.2
SYMBOL diode 128 240 R0
SYMATTR InstName D34
SYMBOL voltage 144 560 R0
WINDOW 123 0 0 Left 2
WINDOW 39 24 124 Left 2
SYMATTR SpiceLine Rser=100m
SYMATTR InstName V14
SYMATTR Value 1.2
SYMBOL diode 128 496 R0
SYMATTR InstName D35
SYMBOL res 3040 -784 R90
WINDOW 0 0 56 VBottom 2
WINDOW 3 32 56 VTop 2
SYMATTR InstName R1
SYMATTR Value 100k
SYMBOL cap 3168 -720 R0
SYMATTR InstName C15
SYMATTR Value 1n
SYMBOL cap 3408 -976 R90
WINDOW 0 0 32 VBottom 2
WINDOW 3 32 32 VTop 2
SYMATTR InstName C16
SYMATTR Value 20n
SYMBOL nmos 3280 -512 M0
SYMATTR InstName M7
SYMBOL nmos 3312 -704 R0
SYMATTR InstName M8
SYMBOL nmos 3472 -704 R0
SYMATTR InstName M9
SYMBOL pmos 3312 -752 M180
SYMATTR InstName M10
SYMBOL pmos 3472 -752 M180
SYMATTR InstName M11
SYMBOL diode 2880 -752 R270
WINDOW 0 32 32 VTop 2
WINDOW 3 0 32 VBottom 2
SYMATTR InstName D15
SYMBOL res 3216 -624 R0
SYMATTR InstName R82
SYMATTR Value 1
SYMBOL res 3984 -752 M0
SYMATTR InstName R87
SYMATTR Value 50k
SYMBOL cap 3888 -736 M0
SYMATTR InstName C17
SYMATTR Value 50n
SYMBOL res 3712 -752 M90
WINDOW 0 0 56 VBottom 2
WINDOW 3 32 56 VTop 2
SYMATTR InstName R88
SYMATTR Value 1k
SYMBOL diode 3648 -720 R270
WINDOW 0 32 32 VTop 2
WINDOW 3 0 32 VBottom 2
SYMATTR InstName D16
SYMBOL res 3056 -784 R0
SYMATTR InstName R89
SYMATTR Value 1Meg
SYMBOL res 3008 80 R90
WINDOW 0 0 56 VBottom 2
WINDOW 3 32 56 VTop 2
SYMATTR InstName R90
SYMATTR Value 100K
SYMBOL cap 3136 144 R0
SYMATTR InstName C18
SYMATTR Value 1n
SYMBOL cap 3376 -112 R90
WINDOW 0 0 32 VBottom 2
WINDOW 3 32 32 VTop 2
SYMATTR InstName C19
SYMATTR Value 20n
SYMBOL nmos 3248 352 M0
SYMATTR InstName M12
SYMBOL nmos 3280 160 R0
SYMATTR InstName M13
SYMBOL nmos 3440 160 R0
SYMATTR InstName M14
SYMBOL pmos 3280 112 M180
SYMATTR InstName M15
SYMBOL pmos 3440 112 M180
SYMATTR InstName M16
SYMBOL diode 2848 112 R270
WINDOW 0 32 32 VTop 2
WINDOW 3 0 32 VBottom 2
SYMATTR InstName D17
SYMBOL res 3184 240 R0
SYMATTR InstName R91
SYMATTR Value 1
SYMBOL res 3952 112 M0
SYMATTR InstName R92
SYMATTR Value 50k
SYMBOL cap 3856 128 M0
SYMATTR InstName C20
SYMATTR Value 50n
SYMBOL res 3680 112 M90
WINDOW 0 0 56 VBottom 2
WINDOW 3 32 56 VTop 2
SYMATTR InstName R93
SYMATTR Value 1k
SYMBOL diode 3616 144 R270
WINDOW 0 32 32 VTop 2
WINDOW 3 0 32 VBottom 2
SYMATTR InstName D18
SYMBOL res 3024 80 R0
SYMATTR InstName R94
SYMATTR Value 1Meg
SYMBOL AHP 80 -1296 R0
SYMATTR InstName X1
SYMATTR SpiceLine Rinhibition = 1Meg
SYMBOL Synapse 400 -1216 R180
SYMATTR InstName X4
SYMBOL res 352 -1200 M0
SYMATTR InstName R2
SYMATTR Value 1000G
SYMBOL Synapse 720 -1216 R180
SYMATTR InstName X5
SYMBOL res 672 -1200 M0
SYMATTR InstName R60
SYMATTR Value 1000G
SYMBOL Opamps\\UniversalOpamp2 1280 592 R0
SYMATTR InstName U2
SYMBOL res 1328 432 R90
WINDOW 0 0 56 VBottom 2
WINDOW 3 32 56 VTop 2
SYMATTR InstName R15
SYMATTR Value 1Meg
SYMBOL Opamps\\UniversalOpamp2 1584 608 R0
SYMATTR InstName U17
SYMBOL res 1632 448 R90
WINDOW 0 0 56 VBottom 2
WINDOW 3 32 56 VTop 2
SYMATTR InstName R62
SYMATTR Value 20k
SYMBOL res 1504 576 R90
WINDOW 0 0 56 VBottom 2
WINDOW 3 32 56 VTop 2
SYMATTR InstName R63
SYMATTR Value 125
SYMBOL res 1056 -32 R90
WINDOW 0 0 56 VBottom 2
WINDOW 3 32 56 VTop 2
SYMATTR InstName R64
SYMATTR Value 1
SYMBOL res 1072 -896 R90
WINDOW 0 0 56 VBottom 2
WINDOW 3 32 56 VTop 2
SYMATTR InstName R65
SYMATTR Value 1
SYMBOL Opamps\\UniversalOpamp2 960 576 R0
SYMATTR InstName U18
SYMBOL res 2080 624 M0
SYMATTR InstName R61
SYMATTR Value 40k
SYMBOL cap 1984 640 M0
SYMATTR InstName C3
SYMATTR Value 5µ
SYMBOL diode 1776 592 M90
WINDOW 0 0 32 VBottom 2
WINDOW 3 32 32 VTop 2
SYMATTR InstName D9
SYMBOL res 1840 592 M90
WINDOW 0 0 56 VBottom 2
WINDOW 3 32 56 VTop 2
SYMATTR InstName R66
SYMATTR Value 10k
SYMBOL Opamps\\UniversalOpamp2 1280 912 R0
SYMATTR InstName U19
SYMBOL res 1328 752 R90
WINDOW 0 0 56 VBottom 2
WINDOW 3 32 56 VTop 2
SYMATTR InstName R68
SYMATTR Value 1Meg
SYMBOL Opamps\\UniversalOpamp2 1584 928 R0
SYMATTR InstName U20
SYMBOL res 1632 768 R90
WINDOW 0 0 56 VBottom 2
WINDOW 3 32 56 VTop 2
SYMATTR InstName R69
SYMATTR Value 20k
SYMBOL res 1504 896 R90
WINDOW 0 0 56 VBottom 2
WINDOW 3 32 56 VTop 2
SYMATTR InstName R71
SYMATTR Value 125
SYMBOL Opamps\\UniversalOpamp2 960 896 R0
SYMATTR InstName U21
SYMBOL res 2064 944 M0
SYMATTR InstName R72
SYMATTR Value 40k
SYMBOL cap 1968 960 M0
SYMATTR InstName C4
SYMATTR Value 5µ
SYMBOL diode 1760 912 M90
WINDOW 0 0 32 VBottom 2
WINDOW 3 32 32 VTop 2
SYMATTR InstName D10
SYMBOL res 1824 912 M90
WINDOW 0 0 56 VBottom 2
WINDOW 3 32 56 VTop 2
SYMATTR InstName R73
SYMATTR Value 10k
SYMBOL res 1984 -864 R90
WINDOW 0 0 56 VBottom 2
WINDOW 3 32 56 VTop 2
SYMATTR InstName R14
SYMATTR Value 1
SYMBOL res 1968 0 R90
WINDOW 0 0 56 VBottom 2
WINDOW 3 32 56 VTop 2
SYMATTR InstName R52
SYMATTR Value 1
SYMBOL res 1072 592 R270
WINDOW 0 32 56 VTop 2
WINDOW 3 0 56 VBottom 2
SYMATTR InstName R33
SYMATTR Value 1
SYMBOL res 1056 912 R270
WINDOW 0 32 56 VTop 2
WINDOW 3 0 56 VBottom 2
SYMATTR InstName R46
SYMATTR Value 1
SYMBOL res 1792 592 R90
WINDOW 0 0 56 VBottom 2
WINDOW 3 32 56 VTop 2
SYMATTR InstName R49
SYMATTR Value 1
SYMBOL res 1760 912 R90
WINDOW 0 0 56 VBottom 2
WINDOW 3 32 56 VTop 2
SYMATTR InstName R67
SYMATTR Value 1
SYMBOL res 1376 -896 R90
WINDOW 0 0 56 VBottom 2
WINDOW 3 32 56 VTop 2
SYMATTR InstName R76
SYMATTR Value 1
SYMBOL res 1360 -32 R90
WINDOW 0 0 56 VBottom 2
WINDOW 3 32 56 VTop 2
SYMATTR InstName R77
SYMATTR Value 1
SYMBOL Opamps\\OP07 2096 -560 R0
SYMATTR InstName U8
SYMBOL Opamps\\OP07 2064 304 R0
SYMATTR InstName U14
SYMBOL Opamps\\OP07 1680 -1216 M0
SYMATTR InstName U1
SYMBOL Opamps\\OP07 1376 -1200 M0
SYMATTR InstName U3
SYMBOL Opamps\\OP07 1344 -336 M0
SYMATTR InstName U9
SYMBOL Opamps\\OP07 1664 -352 M0
SYMATTR InstName U15
SYMBOL Opamps\\OP07 1792 -912 R0
SYMATTR InstName U4
SYMBOL Opamps\\OP07 1488 -928 R0
SYMATTR InstName U7
SYMBOL Opamps\\OP07 1456 -64 R0
SYMATTR InstName U10
SYMBOL Opamps\\OP07 1760 -48 R0
SYMATTR InstName U13
TEXT -360 72 Left 2 !.tran 20
TEXT -1032 -296 Left 2 !.save V(audioin), \n.save V(predict1), V(predict2), \n.save V(nin1), V(nin2),\n.save nout1, nout2
TEXT -1376 -384 Left 2 !.save V(Vmem1_1), \n.save V(Vmem2_1),\n.save V(Vmem3_1),\n.save V(Vmem4_1),\n.save V(Vmem5_1),\n.save V(Vmem6_1), \n.save V(Vmem7_1),\n.save V(Vmem8_1),\n.save V(Vmem1_2), \n.save V(Vmem2_2),\n.save V(Vmem3_2),\n.save V(Vmem4_2),\n.save V(Vmem5_2),\n.save V(Vmem6_2), \n.save V(Vmem7_2),\n.save V(Vmem8_2)
TEXT -1448 216 Left 2 !.save pre1, pre2, pre3, pre4, pre5, pre6, pre7, pre8\n.save post1, post2\n.save teststart
TEXT -1392 312 Left 2 !.save a1_1, a1_2, a1_3, a1_4, a1_5\n.save a2_1, a2_2, a2_3, a2_4, a2_5
TEXT -1880 608 Left 2 ;.save vnmem1, vnmem2, vnout1, vnout2\n.save I(C16), I(C15), I(C19), I(C18), I(M7), I(M12)
TEXT -1384 120 Left 2 !.save f1, f2, f3, f4, f5, f6, f7, f8
TEXT -1184 480 Left 2 !.save predict3, predict4
TEXT -1928 368 Left 2 ;.save I(R65) I(R64) I(R76) I(R77)
TEXT -1912 328 Left 2 ;.save I(R32) I(R14) I(R22) I(R26)
TEXT -1920 416 Left 2 ;.save I(R51) I(R52) I(R41) I(R45)
TEXT -1200 576 Left 2 ;.save I(R33) I(R63) I(R49)
TEXT -1200 624 Left 2 ;.save I(R46) I(R71) I(R67)
TEXT -1192 672 Left 2 ;.save a3_1 a3_2 a3_3 a4_1 a4_2 a4_3
TEXT -1184 520 Left 2 ;.save predict5
TEXT -1872 672 Left 2 ;.save I(R90) I(R1)
TEXT -480 -624 Left 2 !.param tol=0
TEXT -480 -568 Left 2 ;.step param run 1 100 1

The netlist it stands for:
* Net Array_SynapseResponse.asc
XX2 post1 pre2 Vmem2_1 synapse
XX3 F2 pre2 5V+ ahp params: AHP Rinhibition = 1Meg
XX17 post1 pre7 Vmem7_1 synapse
XX18 F7 pre7 5V+ ahp params: AHP Rinhibition = 1Meg
XX20 post2 pre2 Vmem2_2 synapse
XX27 post2 pre7 Vmem7_2 synapse
XX11 Label Label2 outputlabels
V§AudioTrain audioin N020 wavefile=V_train.wav
V§AudioTest N020 0 wavefile=V_test.wav
XX12 F1 F2 F3 F4 F5 F6 F7 F8 audioin filterbank
V1 V+ 0 12 Rser=100m
V2 V- 0 -12 Rser=100m
XX6 post1 pre3 Vmem3_1 synapse
XX7 F3 pre3 5V+ ahp params: AHP Rinhibition = 1Meg
XX9 post2 pre3 Vmem3_2 synapse
XX10 post1 pre4 Vmem4_1 synapse
XX13 F4 pre4 5V+ ahp params: AHP Rinhibition = 1Meg
XX14 post2 pre4 Vmem4_2 synapse
XX15 post1 pre5 Vmem5_1 synapse
XX16 F5 pre5 5V+ ahp params: AHP Rinhibition = 1Meg
XX19 post2 pre5 Vmem5_2 synapse
XX21 post1 pre6 Vmem6_1 synapse
XX22 F6 pre6 5V+ ahp params: AHP Rinhibition = 1Meg
XX23 post2 pre6 Vmem6_2 synapse
XX24 post1 pre8 Vmem8_1 synapse
XX25 F8 pre8 5V+ ahp params: AHP Rinhibition = 1Meg
XX26 post2 pre8 Vmem8_2 synapse
R3 Vmem2_1 0 1000G
R4 Vmem2_2 0 1000G
R5 Vmem3_1 0 1000G
R6 Vmem3_2 0 1000G
R7 Vmem4_1 0 1000G
R8 Vmem4_2 0 1000G
R9 Vmem5_1 0 1000G
R10 Vmem5_2 0 1000G
R11 Vmem6_1 0 1000G
R12 Vmem6_2 0 1000G
R13 Vmem7_1 0 1000G
R17 Vmem7_2 0 1000G
R70 Vmem8_1 0 1000G
R19 Vmem8_2 0 1000G
V3 5V+ 0 5 Rser=100m
R20 a1_5 N001 1k
R21 N001 N002 0.6k
D3 b1 a1_5 D
D4 N008 N009 D
XU5 0 a1_3 V+ V- a1_4 LT1001  ; OP07, pins In+ In- V+ V- OUT
R22 a1_3 N009 1.75k
R23 a1_3 N011 1.2k
R24 a1_4 a1_3 1.5k
XU6 0 N007 V+ V- nin1 LT1001  ; OP07, pins In+ In- V+ V- OUT
R25 nin1 N007 10k
R26 N007 a1_4 10k
D5 Label N011 D
R29 a1_1 N004 2Meg
R31 a1_2 N005 2Meg
R32 N005 a1_1 125
R34 N014 Label2 1k
R35 N015 N014 3k
R38 a1_3 N015 1k
R39 a2_5 N018 1k
R40 N018 N019 0.6k
D6 b2 a2_5 D
D7 P001 N025 D
XU11 0 a2_3 V+ V- a2_4 LT1001  ; OP07, pins In+ In- V+ V- OUT
R41 a2_3 N025 1.75k
R42 a2_3 N028 1.2k
R43 a2_4 a2_3 1.5k
XU12 0 N024 V+ V- nin2 LT1001  ; OP07, pins In+ In- V+ V- OUT
R44 nin2 N024 10k
R45 N024 a2_4 10k
D8 Label2 N028 D
R48 a2_1 N022 2Meg
R50 a2_2 N023 2Meg
R51 N023 a2_1 125
R53 N030 Label 1k
R54 N031 N030 3k
R57 a2_3 N031 1k
R58 N001 testStart 1k
R59 N018 testStart 1k
XX8 testStart starttestlabel
V7 N003 0 1.2 Rser=100m
D28 pre1 N003 D
V8 N006 0 1.2 Rser=100m
D29 pre2 N006 D
V9 N013 0 1.2 Rser=100m
D30 pre3 N013 D
V10 N017 0 1.2 Rser=100m
D31 pre4 N017 D
V11 N021 0 1.2 Rser=100m
D32 pre5 N021 D
V12 N027 0 1.2 Rser=100m
D33 pre6 N027 D
V13 N032 0 1.2 Rser=100m
D34 pre7 N032 D
V14 N036 0 1.2 Rser=100m
D35 pre8 N036 D
R1 Vnmem1 P002 100k
C15 Vnmem1 0 1n
C16 Vnout1 Vnmem1 20n
M7 N016 Vnout1 0 0 NMOS
M8 N010 Vnmem1 0 0 NMOS
M9 Vnout1 N010 0 0 NMOS
M10 N010 Vnmem1 5V+ 5V+ PMOS
M11 Vnout1 N010 5V+ 5V+ PMOS
D15 nin1 P002 D
R82 Vnmem1 N016 1
R87 nout1 0 50k
C17 nout1 0 50n
R88 N012 nout1 1k
D16 Vnout1 N012 D
R89 Vnmem1 0 1Meg
R90 Vnmem2 P003 100K
C18 Vnmem2 0 1n
C19 Vnout2 Vnmem2 20n
M12 N033 Vnout2 0 0 NMOS
M13 N026 Vnmem2 0 0 NMOS
M14 Vnout2 N026 0 0 NMOS
M15 N026 Vnmem2 5V+ 5V+ PMOS
M16 Vnout2 N026 5V+ 5V+ PMOS
D17 nin2 P003 D
R91 Vnmem2 N033 1
R92 nout2 0 50k
C20 nout2 0 50n
R93 N029 nout2 1k
D18 Vnout2 N029 D
R94 Vnmem2 0 1Meg
XX1 F1 pre1 5V+ ahp params: AHP Rinhibition = 1Meg
XX4 post1 pre1 Vmem1_1 synapse
R2 Vmem1_1 0 1000G
XX5 post2 pre1 Vmem1_2 synapse
R60 Vmem1_2 0 1000G
XU2 0 N034 V+ V- a3_2 level.2 Avol=1Meg GBW=10Meg Slew=10Meg ilimit=25m rail=0 Vos=0 phimargin=45 en=0 enk=0 in=0 ink=0 Rin=500Meg  ; pins IN+ IN- V+ V- OUT
R15 a3_2 N034 1Meg
XU17 0 N035 V+ V- a3_3 level.2 Avol=1Meg GBW=10Meg Slew=10Meg ilimit=25m rail=0 Vos=0 phimargin=45 en=0 enk=0 in=0 ink=0 Rin=500Meg  ; pins IN+ IN- V+ V- OUT
R62 a3_3 N035 20k
R63 N035 a3_2 125
R64 b2 post2 1
R65 b1 post1 1
XU18 b1 a3_1 V+ V- a3_1 level.2 Avol=1Meg GBW=10Meg Slew=10Meg ilimit=25m rail=0 Vos=0 phimargin=45 en=0 enk=0 in=0 ink=0 Rin=500Meg  ; pins IN+ IN- V+ V- OUT
R61 predict3 0 40k
C3 predict3 0 5µ
D9 P004 N037 D
R66 N037 predict3 10k
XU19 0 N038 V+ V- a4_2 level.2 Avol=1Meg GBW=10Meg Slew=10Meg ilimit=25m rail=0 Vos=0 phimargin=45 en=0 enk=0 in=0 ink=0 Rin=500Meg  ; pins IN+ IN- V+ V- OUT
R68 a4_2 N038 1Meg
XU20 0 N039 V+ V- a4_3 level.2 Avol=1Meg GBW=10Meg Slew=10Meg ilimit=25m rail=0 Vos=0 phimargin=45 en=0 enk=0 in=0 ink=0 Rin=500Meg  ; pins IN+ IN- V+ V- OUT
R69 a4_3 N039 20k
R71 N039 a4_2 125
XU21 b2 a4_1 V+ V- a4_1 level.2 Avol=1Meg GBW=10Meg Slew=10Meg ilimit=25m rail=0 Vos=0 phimargin=45 en=0 enk=0 in=0 ink=0 Rin=500Meg  ; pins IN+ IN- V+ V- OUT
R72 predict4 0 40k
C4 predict4 0 5µ
D10 N040 N041 D
R73 N041 predict4 10k
R14 N008 a1_2 1
R52 P001 a2_2 1
R33 a3_1 N034 1
R46 a4_1 N038 1
R49 P004 a3_3 1
R67 N040 a4_3 1
R76 N004 b1 1
R77 N022 b2 1
XU8 0 N014 V+ V- N015 LT1001  ; OP07, pins In+ In- V+ V- OUT
XU14 0 N030 V+ V- N031 LT1001  ; OP07, pins In+ In- V+ V- OUT
XU1 nout1 N002 V+ V- N002 LT1001  ; OP07, pins In+ In- V+ V- OUT
XU3 0 N001 V+ V- a1_5 LT1001  ; OP07, pins In+ In- V+ V- OUT
XU9 0 N018 V+ V- a2_5 LT1001  ; OP07, pins In+ In- V+ V- OUT
XU15 nout2 N019 V+ V- N019 LT1001  ; OP07, pins In+ In- V+ V- OUT
XU4 0 N005 V+ V- a1_2 LT1001  ; OP07, pins In+ In- V+ V- OUT
XU7 0 N004 V+ V- a1_1 LT1001  ; OP07, pins In+ In- V+ V- OUT
XU10 0 N022 V+ V- a2_1 LT1001  ; OP07, pins In+ In- V+ V- OUT
XU13 0 N023 V+ V- a2_2 LT1001  ; OP07, pins In+ In- V+ V- OUT

* block symbol definitions
.subckt synapse Vpre Vpost Vmem
R6 0 Vin 10K
B4 Vspk 0 V=2*(v(Vpost)-v(Vpre))
R8 Vpost Vpre R=1/(v(Vmem)+0.0005)*6426871-691000
C3 Vin 0 .1µ V=16 Irms=7.41 Rser=0.000 Lser=0
D2 Vspk N001 OGN4148
R2 Vin N001 10K
B1 N004 0 V=abs(v(Vspk))
C1 Vmem 0 0.8n V=16 Irms=7.41 Rser=0.000 Lser=0
R3 0 Vmem 10000Meg
R4 Vmem N003 50Meg
B3 N002 0 V=0.14 * exp(0.9*v(Vin))
M1 Vmem N005 P001 P001 NMOS
R5 P001 0 20Meg
C2 N005 N004 0.1n
R7 N005 0 50k
D6 N002 N003 D
.model OGN4148 D(Is=4.5e-20 Rs=.568 N=1.752 Cjo=4p M=.4 tt=20n Iave=200m Vpk=75 mfg=OnSemi type=silicon)
* potentiation rate
* depression rate
* Spike Induced Decay Rate
* Full Bridge Rectifier aka absolute value
* absolute value for behavioral sources does some funky stufff
.ends synapse

.subckt ahp Vin Vout 5V+
R1 N001 P001 100K
C1 N001 0 1n
C2 N002 N001 20n
V2 5V+ 0 5
M3 N005 N002 0 0 NMOS
M1 N003 N001 0 0 NMOS
M2 N002 N003 0 0 NMOS
M5 N003 N001 5V+ 5V+ PMOS
M6 N002 N003 5V+ 5V+ PMOS
D3 Vin P001 D
R4 N001 N005 1
R5 Vout 0 50k
C3 Vout 0 50n
R6 N004 Vout 500
D1 N002 N004 D
R7 N001 0 1Meg
.ends ahp

.subckt outputlabels VL0 VL1
V0 VL0 0 PWL( 0.000 0 0.005 0 0.015 3 0.922 3 0.932 0 1.107 0 1.121 0 1.131 0 1.985 0 1.995 0 2.295 0 2.299 0 2.309 3 3.095 3 3.105 0 3.233 0 3.240 0 3.250 0 4.128 0 4.138 0 4.172 0 4.191 0 4.201 3 5.070 3 5.080 0 5.239 0 5.244 0 5.254 0 6.105 0 6.115 0 6.496 0 6.506 0)
V1 VL1 0 PWL( 0.000 0 0.005 0 0.015 0 0.922 0 0.932 0 1.107 0 1.121 0 1.131 3 1.985 3 1.995 0 2.295 0 2.299 0 2.309 0 3.095 0 3.105 0 3.233 0 3.240 0 3.250 3 4.128 3 4.138 0 4.172 0 4.191 0 4.201 0 5.070 0 5.080 0 5.239 0 5.244 0 5.254 3 6.105 3 6.115 0 6.496 0 6.506 0)
V2 VL2 0 PWL( 0.000 0 0.005 0 0.015 3 0.922 3 0.932 0 1.107 0 1.121 0 1.131 0 1.985 0 1.995 0 2.295 0 2.299 0 2.309 3 3.095 3 3.105 0 3.233 0 3.240 0 3.250 0 4.128 0 4.138 0 4.172 0 4.191 0 4.201 3 5.070 3 5.080 0 5.239 0 5.244 0 5.254 0 6.105 0 6.115 0 6.496 0 6.506 0)
V3 VL3 0 PWL( 0.000 0 0.005 0 0.015 0 0.922 0 0.932 0 1.107 0 1.121 0 1.131 3 1.985 3 1.995 0 2.295 0 2.299 0 2.309 0 3.095 0 3.105 0 3.233 0 3.240 0 3.250 3 4.128 3 4.138 0 4.172 0 4.191 0 4.201 0 5.070 0 5.080 0 5.239 0 5.244 0 5.254 3 6.105 3 6.115 0 6.496 0 6.506 0)
V4 VL4 0 PWL( 0.000 0 0.005 0 0.015 3 0.922 3 0.932 0 1.107 0 1.121 0 1.131 0 1.985 0 1.995 0 2.295 0 2.299 0 2.309 3 3.095 3 3.105 0 3.233 0 3.240 0 3.250 0 4.128 0 4.138 0 4.172 0 4.191 0 4.201 3 5.070 3 5.080 0 5.239 0 5.244 0 5.254 0 6.105 0 6.115 0 6.496 0 6.506 0)
V5 VL5 0 PWL( 0.000 0 0.005 0 0.015 0 0.922 0 0.932 0 1.107 0 1.121 0 1.131 3 1.985 3 1.995 0 2.295 0 2.299 0 2.309 0 3.095 0 3.105 0 3.233 0 3.240 0 3.250 3 4.128 3 4.138 0 4.172 0 4.191 0 4.201 0 5.070 0 5.080 0 5.239 0 5.244 0 5.254 3 6.105 3 6.115 0 6.496 0 6.506 0)
V6 VL6 0 PWL( 0.000 0 0.005 0 0.015 3 0.922 3 0.932 0 1.107 0 1.121 0 1.131 0 1.985 0 1.995 0 2.295 0 2.299 0 2.309 3 3.095 3 3.105 0 3.233 0 3.240 0 3.250 0 4.128 0 4.138 0 4.172 0 4.191 0 4.201 3 5.070 3 5.080 0 5.239 0 5.244 0 5.254 0 6.105 0 6.115 0 6.496 0 6.506 0)
V7 VL7 0 PWL( 0.000 0 0.005 0 0.015 0 0.922 0 0.932 0 1.107 0 1.121 0 1.131 3 1.985 3 1.995 0 2.295 0 2.299 0 2.309 0 3.095 0 3.105 0 3.233 0 3.240 0 3.250 3 4.128 3 4.138 0 4.172 0 4.191 0 4.201 0 5.070 0 5.080 0 5.239 0 5.244 0 5.254 3 6.105 3 6.115 0 6.496 0 6.506 0)
.ends outputlabels

.subckt filterbank F1 F2 F3 F4 F5 F6 F7 F8 AudioIn
XU9 0 N004 V+ V- F1 LT1001  ; OP07, pins In+ In- V+ V- OUT
R21 N004 N002 10000.000
R22 F1 N004 185000
XU2 0 N008 V+ V- F2 LT1001  ; OP07, pins In+ In- V+ V- OUT
R3 N008 N006 10000.000
R4 F2 N008 110000
XU7 0 N012 V+ V- F3 LT1001  ; OP07, pins In+ In- V+ V- OUT
R5 N012 N010 10000.000
R6 F3 N012 45000
XU13 0 N016 V+ V- F4 LT1001  ; OP07, pins In+ In- V+ V- OUT
R7 N016 N014 10000.000
R8 F4 N016 65000
XU19 0 N020 V+ V- F5 LT1001  ; OP07, pins In+ In- V+ V- OUT
R17 N020 N018 10000.000
R18 F5 N020 60000
XU23 0 N024 V+ V- F6 LT1001  ; OP07, pins In+ In- V+ V- OUT
R29 N024 N022 10000.000
R30 F6 N024 250000
XU25 0 N028 V+ V- F7 LT1001  ; OP07, pins In+ In- V+ V- OUT
R41 N028 N026 10000.000
R42 F7 N028 375000
XU27 0 N032 V+ V- F8 LT1001  ; OP07, pins In+ In- V+ V- OUT
R49 N032 N030 10000.000
R50 F8 N032 460000
V1 V+ 0 12
V2 V- 0 -12
XU1 0 N007 V+ V- N006 LT1001  ; OP07, pins In+ In- V+ V- OUT
R1 N005 AudioIn 10825.318
C1 N007 N005 45.944n
C2 N006 N005 45.944n
R2 N006 N007 69282.032
XU3 0 N003 V+ V- N002 LT1001  ; OP07, pins In+ In- V+ V- OUT
R9 N001 AudioIn 4002.715
C3 N003 N001 155.319n
C4 N002 N001 155.319n
R10 N002 N003 25617.377
XU4 0 N011 V+ V- N010 LT1001  ; OP07, pins In+ In- V+ V- OUT
R11 N009 AudioIn 7654.655
C5 N011 N009 32.487n
C6 N010 N009 32.487n
R12 N010 N011 48989.795
XU5 0 N023 V+ V- N022 LT1001  ; OP07, pins In+ In- V+ V- OUT
R13 N021 AudioIn 17116.330
C7 N023 N021 5.812n
C8 N022 N021 5.812n
R14 N022 N023 109544.512
XU6 0 N019 V+ V- N018 LT1001  ; OP07, pins In+ In- V+ V- OUT
R15 N017 AudioIn 4419.417
C9 N019 N017 11.254n
C10 N018 N017 11.254n
R16 N018 N019 28284.271
XU8 0 N015 V+ V- N014 LT1001  ; OP07, pins In+ In- V+ V- OUT
R19 N013 AudioIn 23385.359
C11 N015 N013 21.268n
C12 N014 N013 21.268n
R20 N014 N015 149666.295
XU10 0 N031 V+ V- N030 LT1001  ; OP07, pins In+ In- V+ V- OUT
R23 N029 AudioIn 13975.425
C13 N031 N029 3.559n
C14 N030 N029 3.559n
R24 N030 N031 89442.719
XU11 0 N027 V+ V- N026 LT1001  ; OP07, pins In+ In- V+ V- OUT
R25 N025 AudioIn 23385.359
C15 N027 N025 4.254n
C16 N026 N025 4.254n
R26 N026 N027 149666.295
R27 N017 0 17677.670
R28 N001 0 157645.396
R31 N005 0 1665.433
R32 N009 0 2783.511
R33 N013 0 687.805
R34 N025 0 687.805
R35 N029 0 1215.254
R36 N021 0 964.300
* 950-1500
* 1500-1800
* 2200-2500
* 2500-3500
* 3500-4500
* 100-150
* 50-70
* 200-500
* 1500-2000
* 500-2000
* 500-1000
* 2500-5000
* 2250-2750
* 110-210
* 290-580
* 600-900
.ends filterbank

.subckt starttestlabel StartTest
V1 StartTest 0 PULSE(0 12 6.4 .01 .01 10 20 1)
.ends starttestlabel

.model D D
.lib standard.dio
.model NMOS NMOS
.model PMOS PMOS
.lib standard.mos
.tran 20
.save V(audioin),
.save V(predict1), V(predict2),
.save V(nin1), V(nin2),
.save nout1, nout2
.save V(Vmem1_1),
.save V(Vmem2_1),
.save V(Vmem3_1),
.save V(Vmem4_1),
.save V(Vmem5_1),
.save V(Vmem6_1),
.save V(Vmem7_1),
.save V(Vmem8_1),
.save V(Vmem1_2),
.save V(Vmem2_2),
.save V(Vmem3_2),
.save V(Vmem4_2),
.save V(Vmem5_2),
.save V(Vmem6_2),
.save V(Vmem7_2),
.save V(Vmem8_2)
.save pre1, pre2, pre3, pre4, pre5, pre6, pre7, pre8
.save post1, post2
.save teststart
.save a1_1, a1_2, a1_3, a1_4, a1_5
.save a2_1, a2_2, a2_3, a2_4, a2_5
* .save vnmem1, vnmem2, vnout1, vnout2
* .save I(C16), I(C15), I(C19), I(C18), I(M7), I(M12)
.save f1, f2, f3, f4, f5, f6, f7, f8
.save predict3, predict4
* .save I(R65) I(R64) I(R76) I(R77)
* .save I(R32) I(R14) I(R22) I(R26)
* .save I(R51) I(R52) I(R41) I(R45)
* .save I(R33) I(R63) I(R49)
* .save I(R46) I(R71) I(R67)
* .save a3_1 a3_2 a3_3 a4_1 a4_2 a4_3
* .save predict5
* .save I(R90) I(R1)
.param tol=0
* .step param run 1 100 1
.lib LTC.lib
.lib UniversalOpamps2.sub
.backanno
.end